# Altium schematic sheet 充电桩应用监管系统.SchDoc
size A4
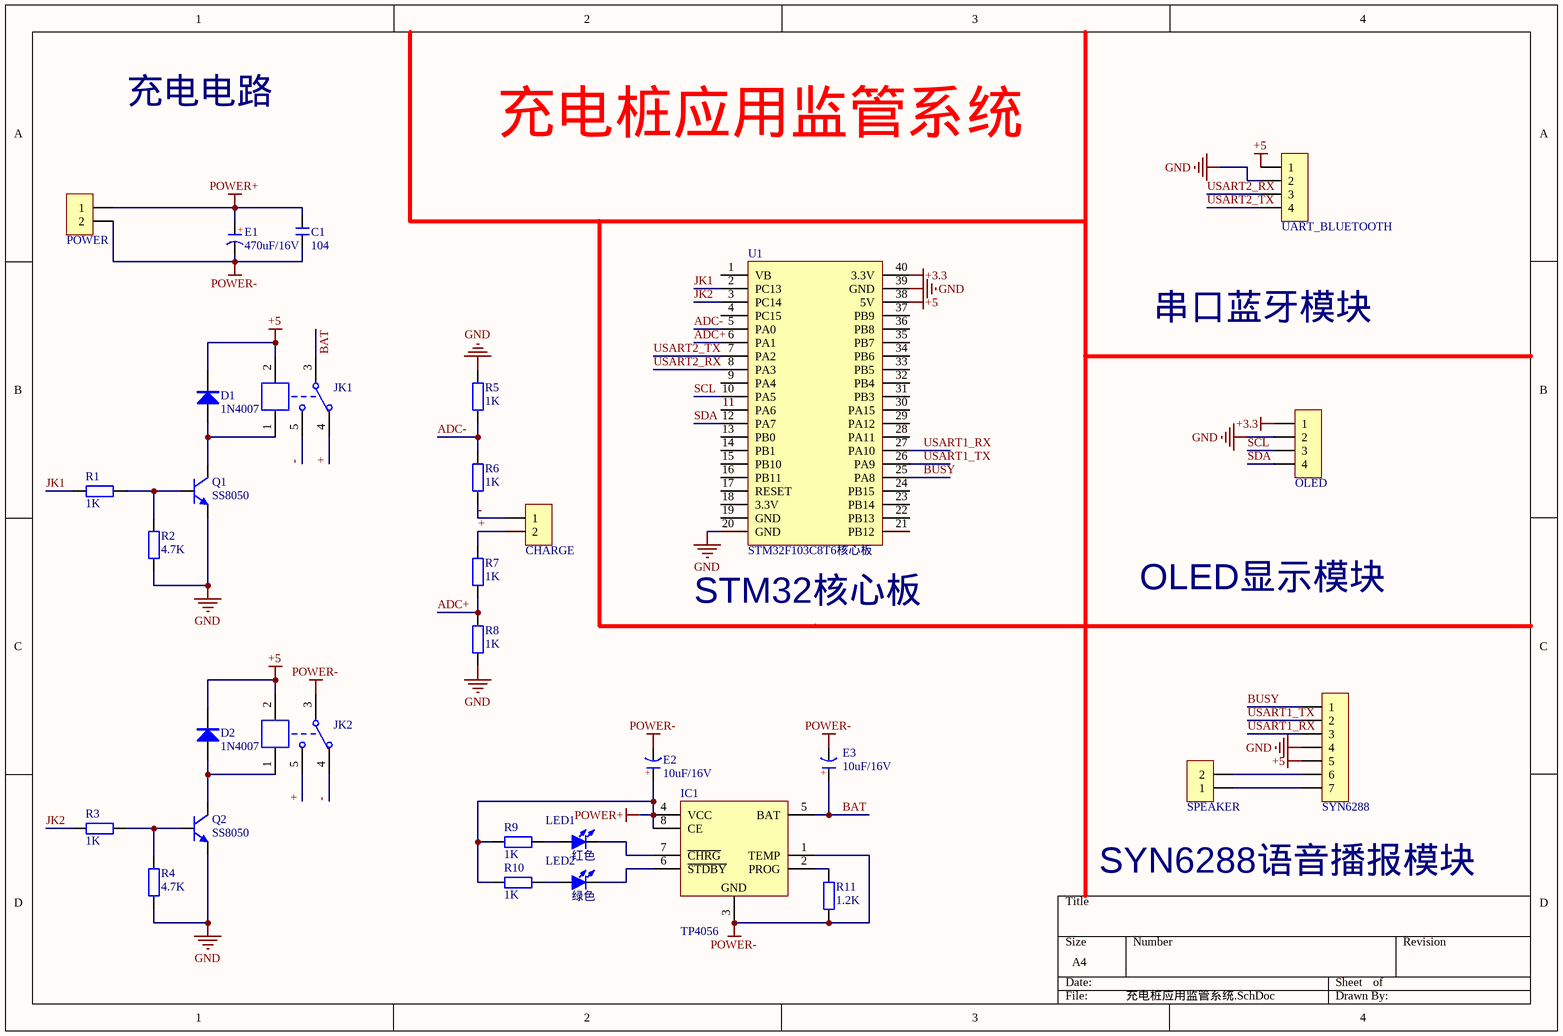
[diagram p0: 充电桩应用监管系统.SchDoc]

## Parts
C1  104  [CC 1.8*3.6]
CHARGE  HDR-1X2  [KF301-5.0-2P]  (value not drawn)
D1  1N4007  [DO-41]
D2  1N4007  [DO-41]
E1  470uF/16V  [CAP 2.0*5*11]
E2  10uF/16V  [CAP 1.5*4*8]
E3  10uF/16V  [CAP 1.5*4*8]
IC1  TP4056  [SOP8_N]
JK1  (no value)  [SRD-C_B]
JK2  (no value)  [SRD-C_B]
LED1  红色  [LED 3MM-B]
LED2  绿色  [LED 3MM-B]
OLED  HDR-1X4  [HDR2.54-M-LI-4P]  (value not drawn)
POWER  HDR-1X2  [KF301-5.0-2P]  (value not drawn)
Q1  SS8050  [TO92A]
Q2  SS8050  [TO92A]
R1  1K  [RS 1/4W]
R2  4.7K  [RS 1/4W]
R3  1K  [RS 1/4W]
R4  4.7K  [RS 1/4W]
R5  1K  [RS 1/4W]
R6  1K  [RS 1/4W]
R7  1K  [RS 1/4W]
R8  1K  [RS 1/4W]
R9  1K  [RS 1/4W]
R10  1K  [RS 1/4W]
R11  1.2K  [RS 1/4W]
SPEAKER  HDR-1X2  [KF301-5.0-2P]  (value not drawn)
SYN6288  HDR-1X7  [PH2.0-LI-7P]  (value not drawn)
U1  STM32F103C8T6核心板  [DIP_TP40-600]
UART_BLUETOOTH  HDR-1X4  [HDR2.54-M-LI-4P]  (value not drawn)

## Nets
+3.3: OLED.1 U1.40(3.3V)
+5: D1.2(K) D2.2(K) JK1.2 JK2.2 SYN6288.5 U1.38(5V) UART_BLUETOOTH.1
GND: OLED.2 Q1.1(E) Q2.1(E) R2.1 R4.1 R5.2 R8.1 SYN6288.4 U1.20(GND) U1.39(GND) UART_BLUETOOTH.2
POWER+: C1.1 E1.1(A) E2.1(A) IC1.4(VCC) IC1.8(CE) POWER.1 R9.1 R10.1
POWER-: C1.2 E1.2(K) E2.2(K) E3.2(K) IC1.1(TEMP) IC1.3(GND) JK2.3 POWER.2 R11.1
+: CHARGE.2 JK1.4 JK2.5 R7.2
-: CHARGE.1 JK1.5 JK2.4 R6.1
ADC+: R7.1 R8.2 U1.6(PA1)
ADC-: R5.1 R6.2 U1.5(PA0)
BAT: E3.1(A) IC1.5(BAT) JK1.3
BUSY: SYN6288.1 U1.25(PA8)
JK1: R1.1 U1.2(PC13)
JK2: R3.1 U1.3(PC14)
SCL: OLED.3 U1.10(PA5)
SDA: OLED.4 U1.12(PA7)
USART1_RX: SYN6288.3 U1.27(PA10)
USART1_TX: SYN6288.2 U1.26(PA9)
USART2_RX: U1.8(PA3) UART_BLUETOOTH.3
USART2_TX: U1.7(PA2) UART_BLUETOOTH.4
NetD1_1: D1.1(A) JK1.1 Q1.3(C)
NetD2_1: D2.1(A) JK2.1 Q2.3(C)
NetIC1_2: IC1.2(PROG) R11.2
NetIC1_6: IC1.6(~{STDBY}) LED2.2(K)
NetIC1_7: IC1.7(~{CHRG}) LED1.2(K)
NetLED1_1: LED1.1(A) R9.2
NetLED2_1: LED2.1(A) R10.2
NetQ1_2: Q1.2(B) R1.2 R2.2
NetQ2_2: Q2.2(B) R3.2 R4.2
NetSPEAKER_1: SPEAKER.1 SYN6288.7
NetSPEAKER_2: SPEAKER.2 SYN6288.6

Not connected (* = marked no-connect by the designer): U1 1(VB) 4(PC15) 9(PA4) 11(PA6) 13(PB0) 14(PB1) 15(PB10) 16(PB11) 17(RESET) 18(3.3V) 19(GND) 21(PB12) 22(PB13) 23(PB14) 24(PB15) 28(PA11) 29(PA12) 30(PA15) 31(PB3) 32(PB4) 33(PB5) 34(PB6) 35(PB7) 36(PB8) 37(PB9)

## Notes on the sheet
- 充电电路
- 充电桩应用监管系统
- 串口蓝牙模块
- (near U1) STM32核心板
- OLED显示模块
- SYN6288语音播报模块
- (in symbol C-CAP) +

## Library data of the parts
C1 = C-CC: 直插瓷片电容; 版权归属: 源创客; BOM名称: 直插瓷片电容; 学习资源: www.ooocke.com
CHARGE POWER SPEAKER = Header 2: 2P接插件; 版权归属: 源创客; BOM名称: 2P接插件; 学习资源: www.ooocke.com
D1 D2 = 1N4007: 整流二极管; 版权归属: 源创客; BOM名称: 整流二极管; 学习资源: www.ooocke.com
E1-E3 = C-CAP: 直插电解电容; 版权归属: 源创客; BOM名称: 直插电解电容; 学习资源: www.ooocke.com
IC1 = TP4056: 锂电池充电管理; 版权归属: 源创客; BOM名称: 锂电池充电管理; 学习资源: www.ooocke.com
JK1 JK2 = SRD-05VDC-SL-C: 5V一组转换; BOM名称: 5V继电器; 版权归属: 源创客; 学习资源: www.ooocke.com
LED1 LED2 = LED-3MM: 插件LED; 版权归属: 源创客; BOM名称: 插件LED; 学习资源: www.ooocke.com
OLED UART_BLUETOOTH = Header 4: 4P接插件; 版权归属: 源创客; BOM名称: 4P接插件; 学习资源: www.ooocke.com
Q1 Q2 = 8050-DIP: 高频放大-NPN型; 版权归属: 源创客; 属性: 40V 1.5A 1W 100MHZ; BOM名称: 高频放大-NPN型; 学习资源: www.ooocke.com
R1-R11 = R-CRR: 直插色环电阻; BOM名称: 色环电阻; 版权归属: 源创客; 学习资源: www.ooocke.com
SYN6288 = Header 7: 7P接插件; 版权归属: 源创客; BOM名称: 7P接插件; 学习资源: www.ooocke.com